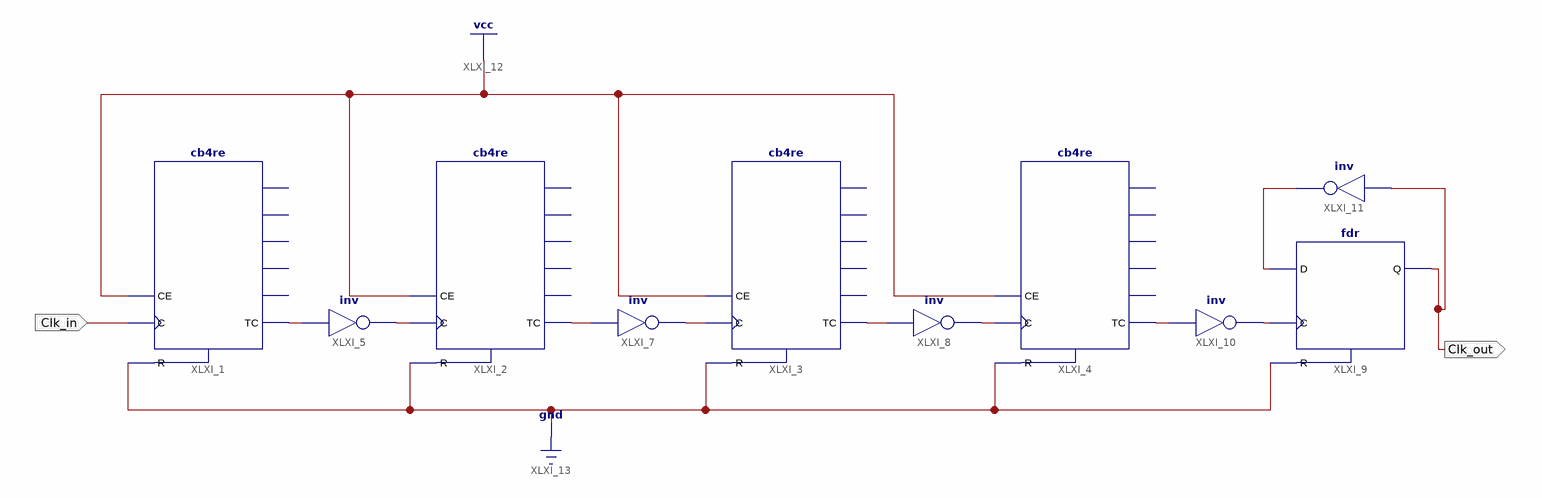
[diagram p0: schematic sheet 1]
// Xilinx ISE schematic DividerFor7segment.sch (spartan6) as structural Verilog: 10 symbols, 2 ports
module DividerFor7segment (
  input  Clk_in,
  output Clk_out
);

  wire XLXN_1, XLXN_2, XLXN_3, XLXN_4, XLXN_5, XLXN_6, XLXN_7, XLXN_8, XLXN_16;

  cb4re XLXI_1 (.C(Clk_in), .CE(1'b1), .R(1'b0), .TC(XLXN_1));  // open: CEO, Q0, Q1, Q2, Q3
  cb4re XLXI_2 (.C(XLXN_2), .CE(1'b1), .R(1'b0), .TC(XLXN_3));  // open: CEO, Q0, Q1, Q2, Q3
  cb4re XLXI_3 (.C(XLXN_4), .CE(1'b1), .R(1'b0), .TC(XLXN_5));  // open: CEO, Q0, Q1, Q2, Q3
  cb4re XLXI_4 (.C(XLXN_6), .CE(1'b1), .R(1'b0), .TC(XLXN_7));  // open: CEO, Q0, Q1, Q2, Q3
  not XLXI_5 (XLXN_2, XLXN_1);
  not XLXI_7 (XLXN_4, XLXN_3);
  not XLXI_8 (XLXN_6, XLXN_5);
  fdr XLXI_9 (.C(XLXN_8), .D(XLXN_16), .R(1'b0), .Q(Clk_out));
  not XLXI_10 (XLXN_8, XLXN_7);
  not XLXI_11 (XLXN_16, Clk_out);
endmodule
